# Altium schematic sheet Wi-Fi_BT.SchDoc
size A3; SheetNumber: 7; SheetTotal: 20
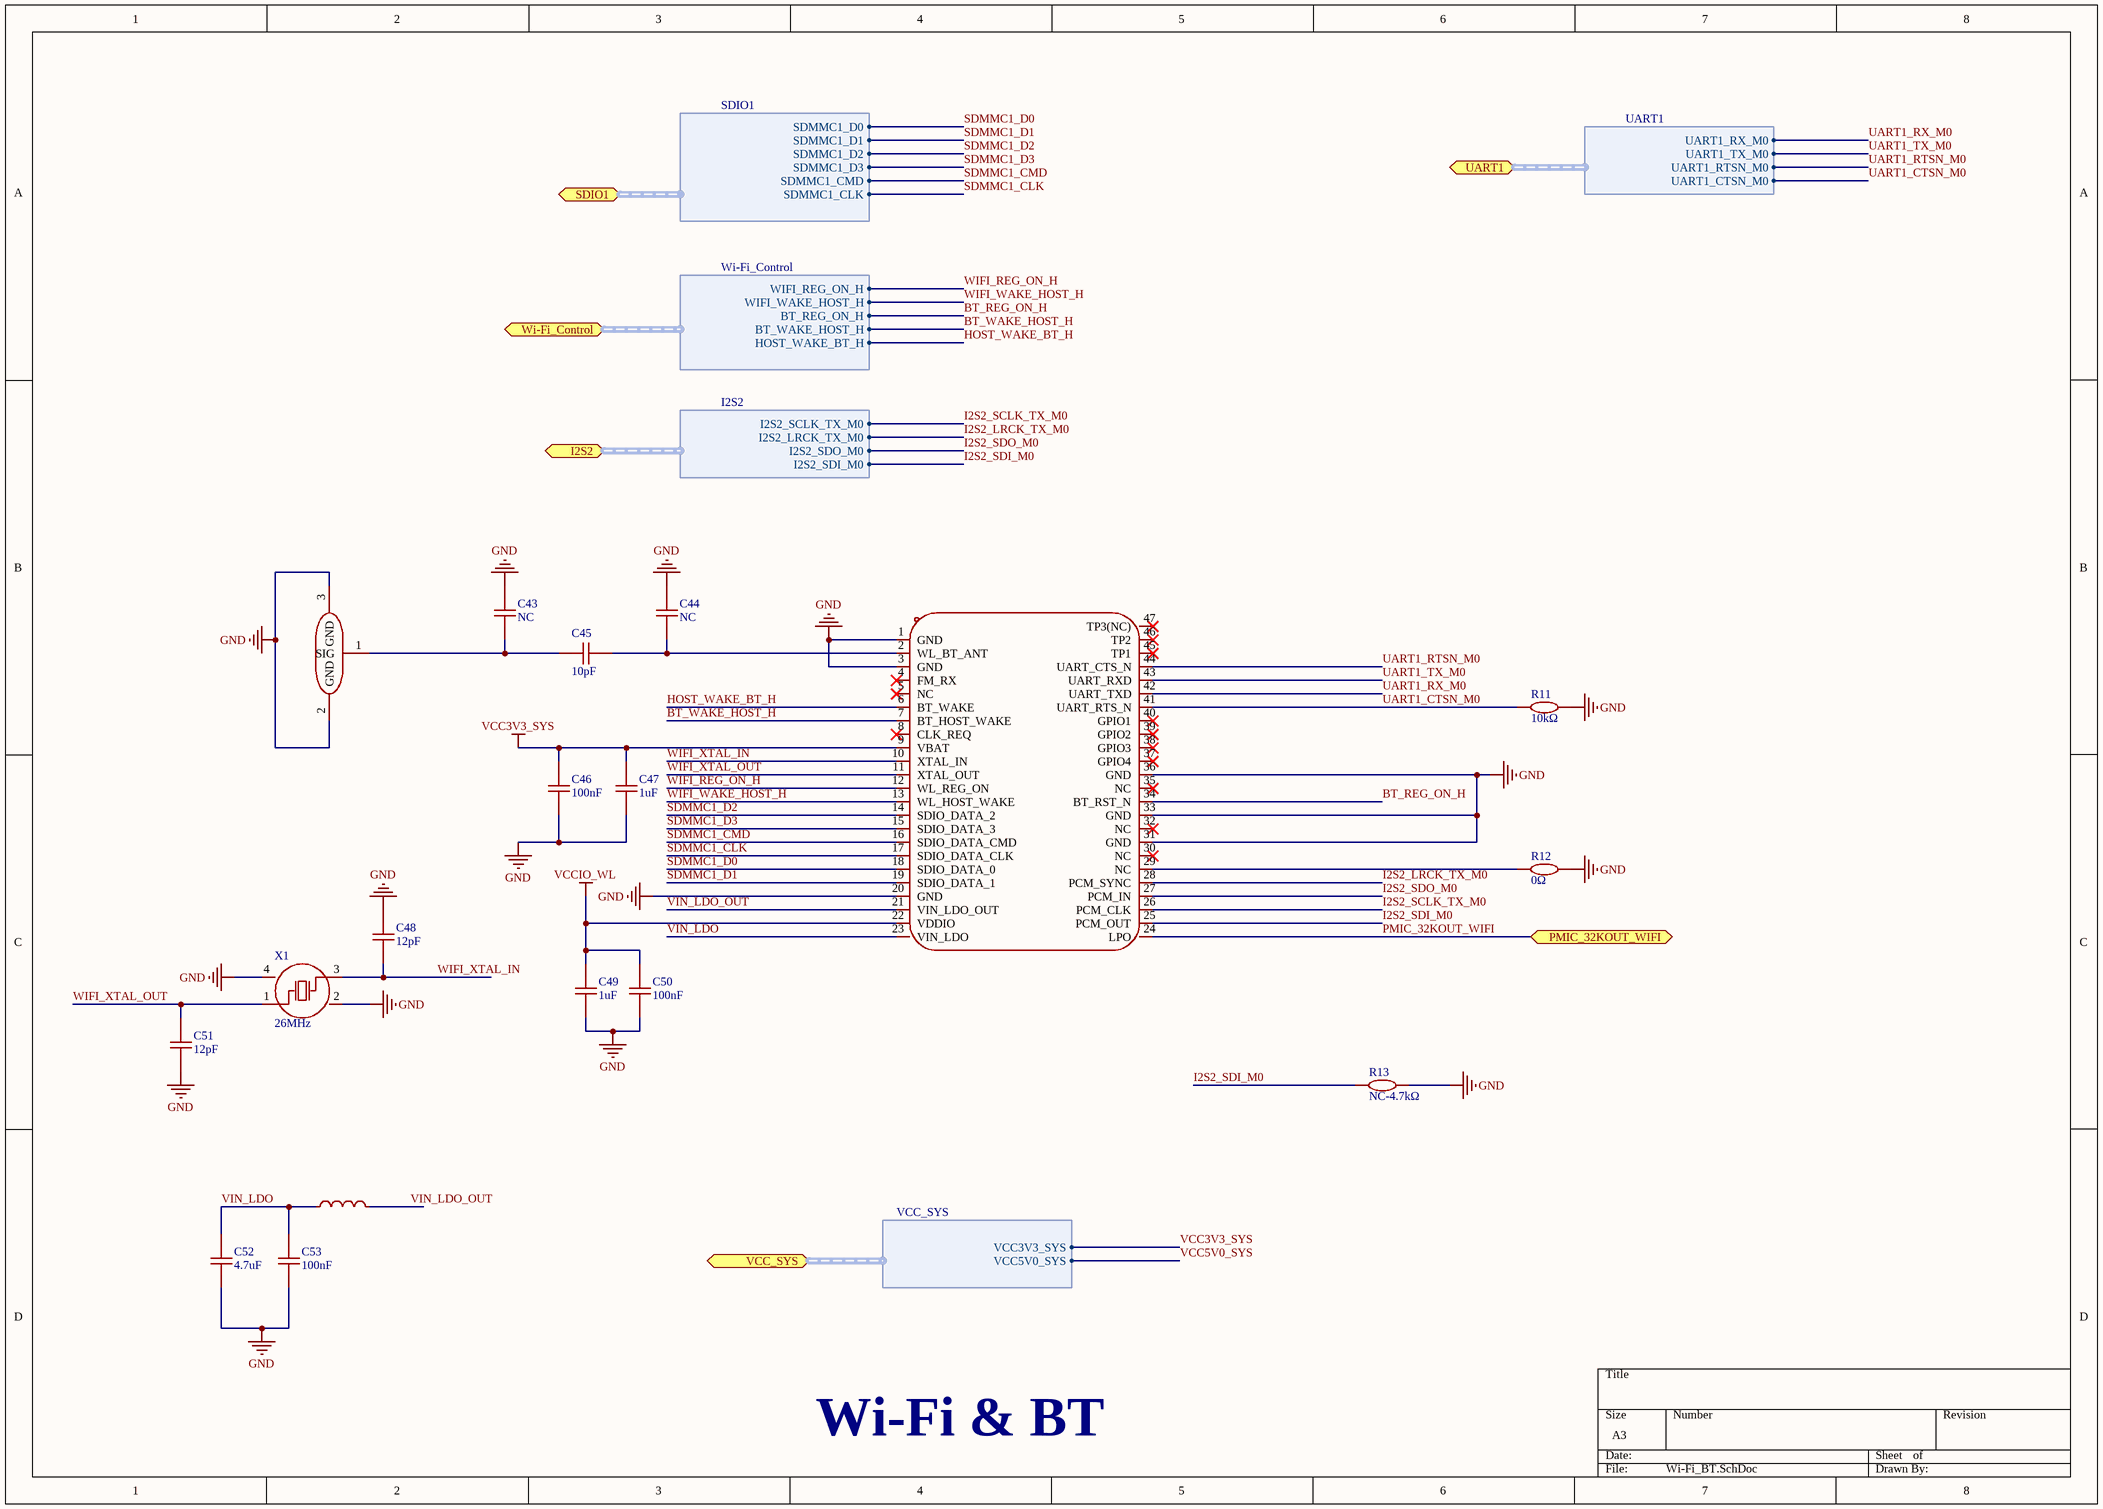
[diagram p0: Wi-Fi_BT.SchDoc]

## Parts
C43  NC  [C0402]
C44  NC  [C0402]
C45  10pF  [C0402]
C46  100nF  [C0402]
C47  1uF  [C0402]
C48  12pF  [C0402]
C49  1uF  [C0402]
C50  100nF  [C0402]
C51  12pF  [C0402]
C52  4.7uF  [C0402]
C53  100nF  [C0402]
JP1  6GHz  [RF-SMD_FRF05002-JSS103M]  (value not drawn)
L1  4.7uH  [L1008]  (value not drawn)
R11  10kΩ  [R0402]
R12  0Ω  [R0402]
R13  NC-4.7kΩ  [R0402]
U12  2.4GHz  [QFN-44_L12.0-W12.0-P0.90-TL_AP6212]  (value not drawn)
X1  26MHz  [CRYSTAL-SMD_4P-L2.0-W1.6-BL]

## Ports
I2S2 (bidir, harness I2S2, see Overview[6C], RK3566[3B], RK3566_FLASH_SD_SARADC[6B]), PMIC_32KOUT_WIFI (bidir, see Overview[7C], POWER[3D], POWER_PMIC[7A]), SDIO1 (bidir, harness SDIO1, see Overview[6C], RK3566[3B], RK3566_FLASH_SD_SARADC[6A]), UART1 (bidir, harness UARt1, see Overview[6C], RK3566[3B], RK3566_FLASH_SD_SARADC[6B]), VCC_SYS (bidir, harness VCC_SYS, see Overview[7C], Audio_AND_HPJ[3A], DEBUG_AND_GPIO[1D], HDMI[2C], MIPI_DSI_TP[6A], POWER[3B], POWER[6B], POWER_EXTENSION[4D], POWER_FLASH_POWER_MANAGE[3C], POWER_PMIC[6D]), Wi-Fi_Control (bidir, harness Wi-Fi_Control, see Overview[6C], RK3566[3B], RK3566_FLASH_SD_SARADC[6A])

## Harnesses
SDIO1: SDMMC1_D0, SDMMC1_D1, SDMMC1_D2, SDMMC1_D3, SDMMC1_CMD, SDMMC1_CLK
Wi-Fi_Control: WIFI_REG_ON_H, WIFI_WAKE_HOST_H, BT_REG_ON_H, BT_WAKE_HOST_H, HOST_WAKE_BT_H
I2S2: I2S2_SCLK_TX_M0, I2S2_LRCK_TX_M0, I2S2_SDO_M0, I2S2_SDI_M0
UART1: UART1_RX_M0, UART1_TX_M0, UART1_RTSN_M0, UART1_CTSN_M0
VCC_SYS: VCC3V3_SYS, VCC5V0_SYS

## Nets
GND: C43.2 C44.2 C46.1 C47.1 C48.2 C49.1 C50.1 C51.1 C52.1 C53.1 JP1.2(GND) JP1.3(GND) R11.2 R12.2 R13.2 U12.1(GND) U12.3(GND) U12.20(GND) U12.31(GND) U12.33(GND) U12.36(GND) X1.2(GND) X1.4(GND)
VCC3V3_SYS: C46.2 C47.2 U12.9(VBAT) ; port VCC_SYS.VCC3V3_SYS
VCCIO_WL: C49.2 C50.2 U12.22(VDDIO)
BT_REG_ON_H: U12.34(BT_RST_N) ; port Wi-Fi_Control.BT_REG_ON_H
BT_WAKE_HOST_H: U12.7(BT_HOST_WAKE) ; port Wi-Fi_Control.BT_WAKE_HOST_H
HOST_WAKE_BT_H: U12.6(BT_WAKE) ; port Wi-Fi_Control.HOST_WAKE_BT_H
I2S2_LRCK_TX_M0: U12.28(PCM_SYNC) ; port I2S2.I2S2_LRCK_TX_M0
I2S2_SCLK_TX_M0: U12.26(PCM_CLK) ; port I2S2.I2S2_SCLK_TX_M0
I2S2_SDI_M0: R13.1 U12.25(PCM_OUT) ; port I2S2.I2S2_SDI_M0
I2S2_SDO_M0: U12.27(PCM_IN) ; port I2S2.I2S2_SDO_M0
PMIC_32KOUT_WIFI: U12.24(LPO) ; port PMIC_32KOUT_WIFI
SDMMC1_CLK: U12.17(SDIO_DATA_CLK) ; port SDIO1.SDMMC1_CLK
SDMMC1_CMD: U12.16(SDIO_DATA_CMD) ; port SDIO1.SDMMC1_CMD
SDMMC1_D0: U12.18(SDIO_DATA_0) ; port SDIO1.SDMMC1_D0
SDMMC1_D1: U12.19(SDIO_DATA_1) ; port SDIO1.SDMMC1_D1
SDMMC1_D2: U12.14(SDIO_DATA_2) ; port SDIO1.SDMMC1_D2
SDMMC1_D3: U12.15(SDIO_DATA_3) ; port SDIO1.SDMMC1_D3
UART1_CTSN_M0: R11.1 U12.41(UART_RTS_N) ; port UART1.UART1_CTSN_M0
UART1_RTSN_M0: U12.44(UART_CTS_N) ; port UART1.UART1_RTSN_M0
UART1_RX_M0: U12.42(UART_TXD) ; port UART1.UART1_RX_M0
UART1_TX_M0: U12.43(UART_RXD) ; port UART1.UART1_TX_M0
VCC5V0_SYS: port VCC_SYS.VCC5V0_SYS
VIN_LDO: C52.2 C53.2 L1.1 U12.23(VIN_LDO)
VIN_LDO_OUT: L1.2 U12.21(VIN_LDO_OUT)
WIFI_REG_ON_H: U12.12(WL_REG_ON) ; port Wi-Fi_Control.WIFI_REG_ON_H
WIFI_WAKE_HOST_H: U12.13(WL_HOST_WAKE) ; port Wi-Fi_Control.WIFI_WAKE_HOST_H
WIFI_XTAL_IN: C48.1 U12.10(XTAL_IN) X1.3(OSC2)
WIFI_XTAL_OUT: C51.2 U12.11(XTAL_OUT) X1.1(OSC1)
NetC43_1: C43.1 C45.1 JP1.1(SIG)
NetC44_1: C44.1 C45.2 U12.2(WL_BT_ANT)
NetR12_1: R12.1 U12.29(NC)

Not connected (* = marked no-connect by the designer): U12 4(FM_RX)* 5(NC)* 8(CLK_REQ)* 30(NC)* 32(NC)* 35(NC)* 37(GPIO4)* 38(GPIO3)* 39(GPIO2)* 40(GPIO1)* 45(TP1)* 46(TP2)* 47(TP3(NC))*

## Notes on the sheet
- Wi-Fi & BT

## Library data of the parts
C43 C44 = 1nF: 50V 1nF X7R ±10% 0402 Ceramic Capacitors ROHS
C45 = 10pF: 50V 10pF C0G ±5% 0402 Ceramic Capacitors ROHS
C46 C50 C53 = 100nF: 50V 100nF X7R ±10% 0402 Ceramic Capacitors ROHS
C47 C49 = 1uF: 50V 1uF X5R ±10% 0402 Ceramic Capacitors ROHS
C48 C51 = 12pF: 50V 12pF C0G ±5% 0402 Ceramic Capacitors ROHS
C52 = 4.7uF: 10V 4.7uF X5R ±20% 0402 Ceramic Capacitors ROHS
JP1 = U.FL-R-SMT-1(80)_C88374: Manufacturer: HRS(广濑); Add into BOM: yes; Connector Type: Board Side; Interface: Male Pin; Number of Ports: 1; Interface Diameter: 2mm; Interface Length/Height: 1.25mm; RF Series: IPEX; Impedance: 50Ω; Symbol: U.FL-R-SMT-1(80); Device: U.FL-R-SMT-1(80)_C88374; LCSC Part Name: IPEX 内针; Supplier Part: C88374; Manufacturer Part: U.FL-R-SMT-1(80); Supplier Footprint: SMD; JLCPCB Part Class: Extended Part; Datasheet: https://item.szlcsc.com/datasheet/U.FL-R-SMT-1(80)/89553.html; Supplier: LCSC; Convert to PCB: yes; Value: 6GHz; Style: -; Operating Temperature Range: -40℃~+90℃
L1 = MLP2520S4R7MT0S1: SMD 1008 4.7uH ±20%; Manufacturer: Sunltech(顺磁); Symbol: SLW4030S1R0NST; Add into BOM: yes; Value: 1uH; Tolerance: ±30%; Current Rating: 4.15A; DC Resistance(DCR): 18mΩ; Device: SLW4030S1R0NST; LCSC Part Name: 1uH ±30%; Supplier Part: C206354; Manufacturer Part: SLW4030S1R0NST; Supplier Footprint: SMD,4x4mm; JLCPCB Part Class: Extended Part; Datasheet: https://item.szlcsc.com/datasheet/SLW4030S1R0NST/207399.html; Supplier: LCSC; Convert to PCB: yes
R11 = 10kΩ: 62.5mW 10kΩ 50V ±100ppm/℃ Thick Film Resistor ±1% 0402 Chip Resistor - Surface Mount ROHS
R12 = 0Ω: 0Ω 62.5mW 50V Thick Film Resistor ±1% 0402 Chip Resistor - Surface Mount ROHS
R13 = 5.1kΩ: 5.1kΩ 62.5mW 50V ±100ppm/℃ Thick Film Resistor ±1% 0402 Chip Resistor - Surface Mount ROHS
U12 = AP6212: 2.4GHz -90dBm QFN-44(12x12) RF Transceiver Modules and Modems ROHS; Manufacturer: AMPAK(正基科技); Add into BOM: yes; Interface Type: On-board PCB antenna; Output Power: 16dBm; Symbol: AP6212; Device: AP6212; LCSC Part Name: AP6212; Supplier Part: C2798300; Manufacturer Part: AP6212; Supplier Footprint: QFN-44(12x12); JLCPCB Part Class: Extended Part; Datasheet: https://item.szlcsc.com/datasheet/AP6212/2941698.html; Supplier: LCSC; Convert to PCB: yes; Utilized IC / Part: -; Wireless Standard: -; Value: 2.4GHz; Antenna Type: -; Voltage - Supply: -; Receive  Current: -; Send  Current: -; Sensitivity: -90dBm; Operating Temperature: -30℃~+85℃
X1 = Q22FA12800230: Q22FA12800230 26MHz ±10ppm 10pF